# EAGLE board vocore2-motherboard (EAGLE 9.3.2)
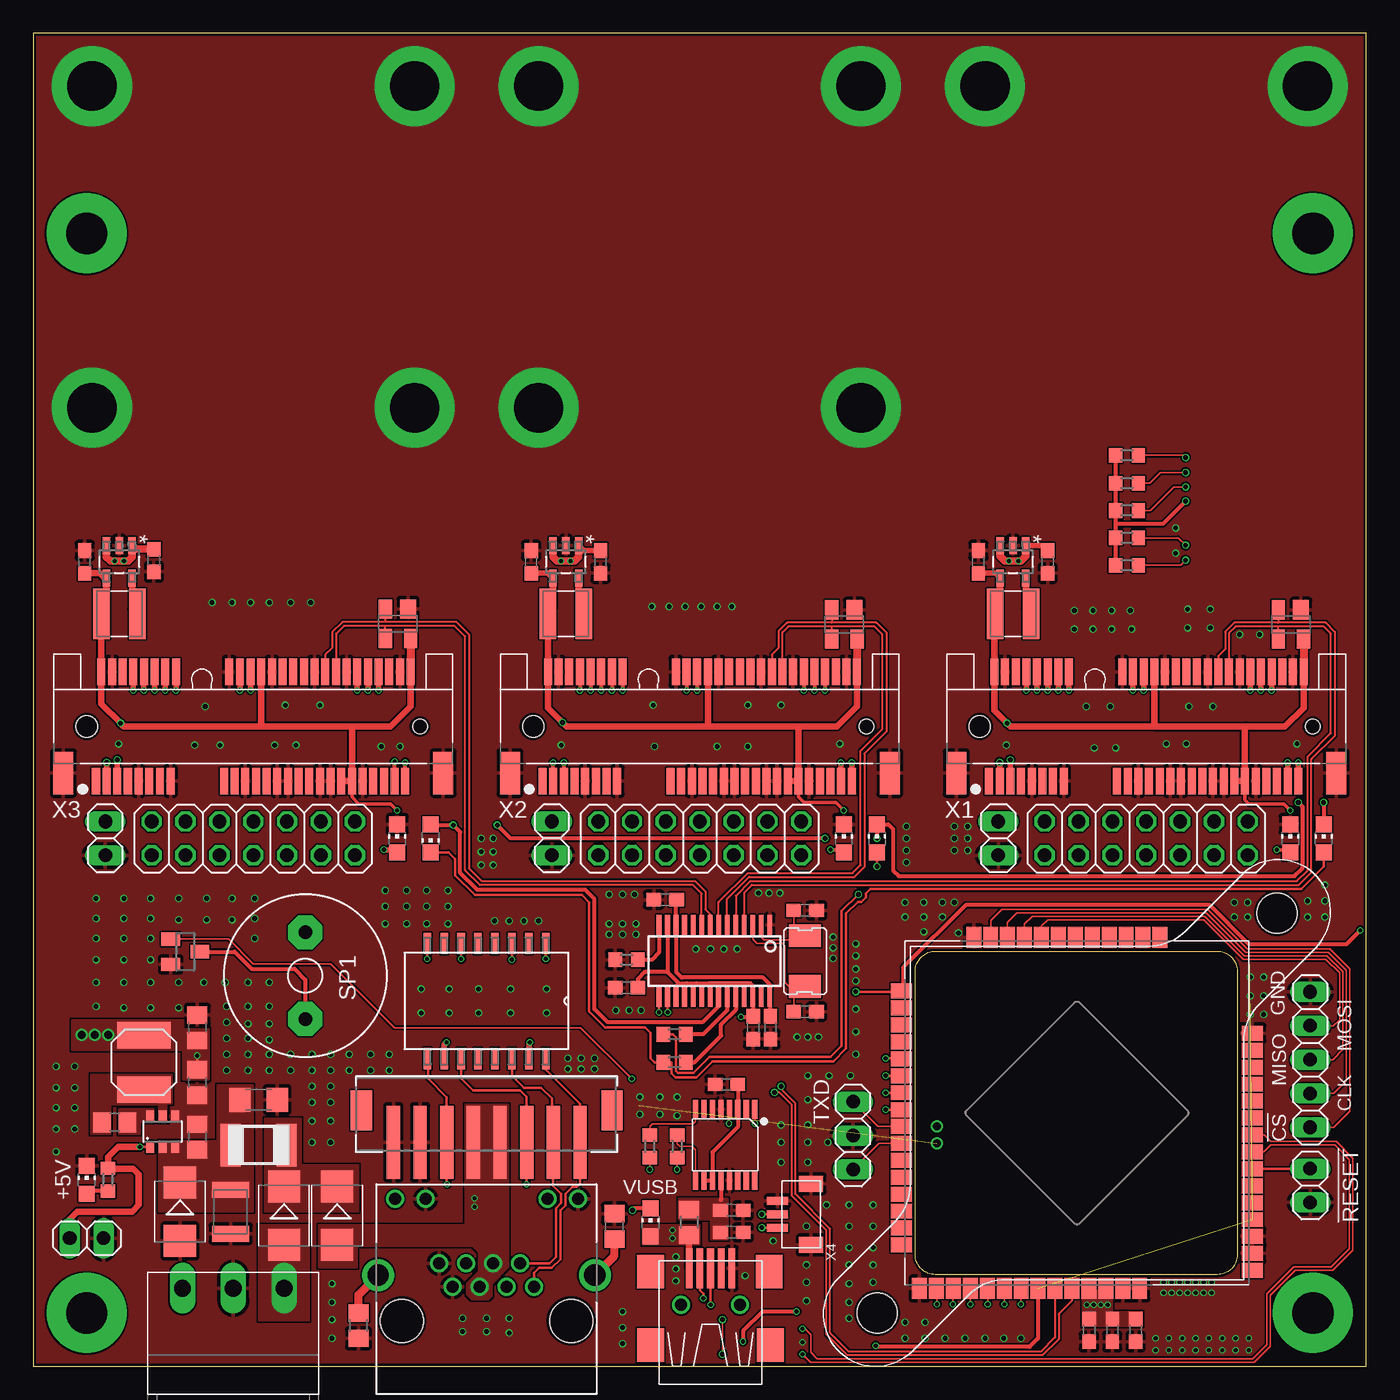
[diagram p4: board, top side]
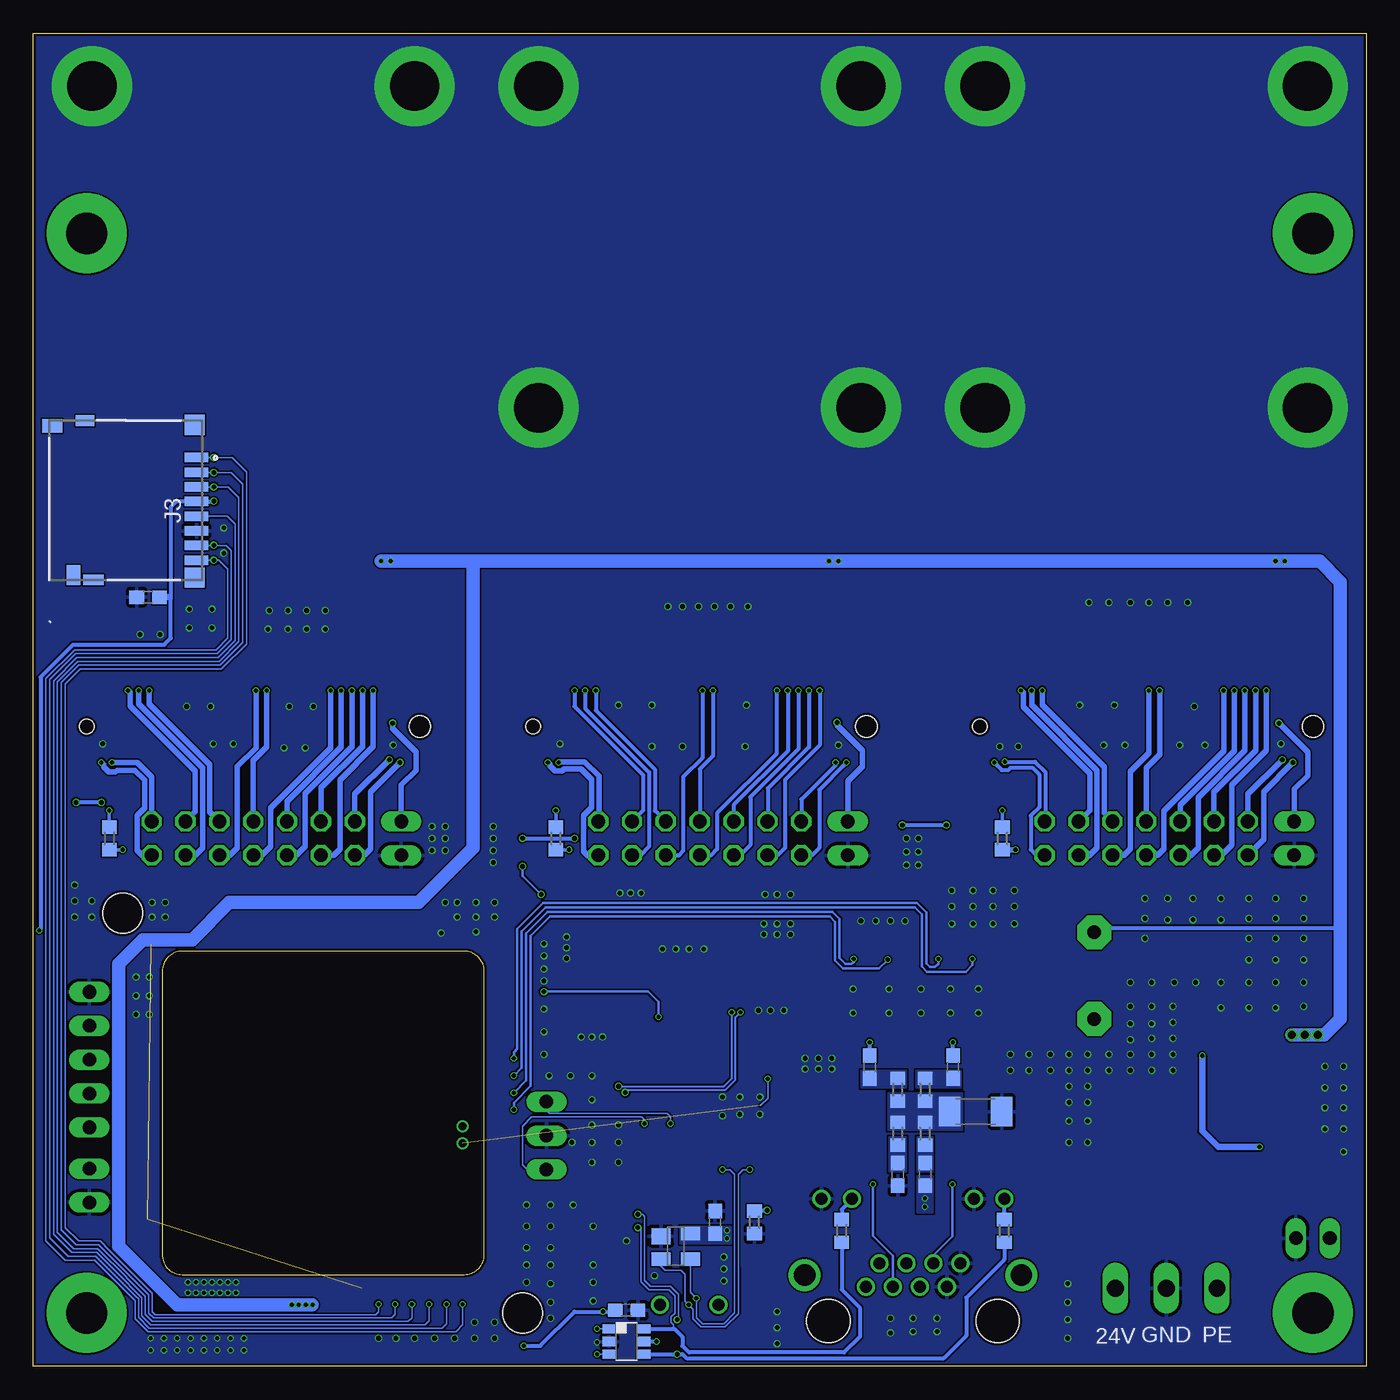
[diagram p5: board, bottom side, seen from below]

Size 100 x 100 mm. Coordinates in mm from the lower left corner, seen from the top.
Outline: 0,0 100,0 100,100 0,100 0,0
Copper layers (1*16): Top 0.035559375mm / dielectric 1.6mm / Bottom 0.035559375mm
Design rules "jlcpcb2layer": minimum track width 5mil, minimum drill 12mil, track to track 5mil, track to pad 5mil, pad to pad 5mil, via to via 5mil, smd to smd 5mil, copper to edge 8mil, drill to drill 6mil, minimum pad ring 5mil, minimum via ring 3mil, stop-mask expansion 2.5mil, vias tented up to drill 0mil, thermal gap 10mil

## Footprints (pad centres in the part's own frame; a part is rotated, then mirrored left to right if it is on the bottom)
C0805 = smd 1.3 x 1.5: 1 -0.95,0; 2 0.95,0
C0603 = smd 1.1 x 1: 1 -0.85,0; 2 0.85,0
C1206 = smd 1.6 x 1.8: 1 -1.4,0; 2 1.4,0
C1808 = smd 1.6 x 2.2: 1 -1.95,0; 2 1.95,0
SMB = smd 2.4 x 2.4: A 2.2,0; C -2.2,0
SOT143 = smd 1.2 x 1.44: 1 -0.75,-1.1 | smd 1 x 1.44: 2 0.95,-1.1; 3 0.95,1.1; 4 -0.95,1.1
1812 = smd 1.5 x 3.2: 1 -2.1,0; 2 2.1,0
SOT23-6 = smd 0.6 x 0.9: 1 -0.95,-1.15; 2 0,-1.15; 3 0.95,-1.15; 4 0.95,1.15; 5 0,1.15; 6 -0.95,1.15
FE1.1S_SSOP-28 = smd 0.35 x 1.5: 1 -4.16,-2.7; 2 -3.52,-2.7; 3 -2.88,-2.7; 4 -2.24,-2.7; 5 -1.6,-2.7; 6 -0.96,-2.7; 7 -0.32,-2.7; 8 0.32,-2.7; 9 0.96,-2.7; 10 1.6,-2.7; 11 2.24,-2.7; 12 2.88,-2.7; 13 3.52,-2.7; 14 4.16,-2.7; 15 4.16,2.7; 16 3.52,2.7; 17 2.88,2.7; 18 2.24,2.7; 19 1.6,2.7; 20 0.96,2.7; 21 0.32,2.7; 22 -0.3,2.7; 23 -0.96,2.7; 24 -1.6,2.7; 25 -2.24,2.7; 26 -2.88,2.7; 27 -3.52,2.7; 28 -4.16,2.7
SOT95P284X122-5N = smd 1.27 x 0.559: 1 -1.219,0.965; 2 -1.219,0; 3 -1.219,-0.965; 4 1.219,-0.965; 5 1.219,0.965
DBV_R-PDSO-G6 = smd 0.69 x 0.99: 1 -0.95,-1.29; 2 0,-1.29; 3 0.95,-1.29; 4 0.95,1.3; 5 0,1.3; 6 -0.95,1.3
SSOP16-0.635-5X4MM = smd 0.381 x 1.397: 1 -2.223,-2.667; 2 -1.587,-2.667; 3 -0.953,-2.667; 4 -0.318,-2.667; 5 0.318,-2.667; 6 0.953,-2.667; 7 1.587,-2.667; 8 2.223,-2.667; 9 2.223,2.667; 10 1.587,2.667; 11 0.953,2.667; 12 0.318,2.667; 13 -0.318,2.667; 14 -0.953,2.667; 15 -1.587,2.667; 16 -2.223,2.667
AMPHENOL_RJHSE-5381 = drill 0.9: 1 3.55,2.54; 2 2.53,4.32; 3 1.52,2.54; 4 0.5,4.32; 5 -0.51,2.54; 6 -1.53,4.32; 7 -2.54,2.54; 8 -3.56,4.32; 9 6.86,9.14; 10 4.57,9.14; 11 -4.57,9.14; 12 -6.86,9.14 | drill 1.6: S1 8.13,3.43; S2 -8.13,3.43 | hole 3.25: 6.35,0; -6.35,0
CONN8_1775470-8 = smd 1 x 5.5: 1 -7.015,0; 2 -5.015,0; 3 -3.015,0; 4 -1.015,0; 5 0.985,0; 6 2.985,0; 7 4.985,0; 8 6.985,0 | smd 1.6 x 3: 9 -9.415,-2.4; 10 9.385,-2.4
AMPHENOL_1140084168 = smd 0.7 x 1.75: 1 9.175,-11.038; 6 3.675,-11.038 | smd 0.701 x 1.753: 2 8.075,-11.038; 8 1.475,-11.038 | smd 0.701 x 1.752: 3 6.975,-11.038; 4 5.875,-11.038; 5 4.775,-11.038; 7 2.575,-11.038 | smd 1.501 x 1.501: 9 0.175,-10.913 | smd 1.502 x 1.502: 10 11.625,-10.913 | smd 0.801 x 1.501: 11 0,-3.313 | smd 0.8 x 1.401: 12 11.95,-2.663 | smd 1.001 x 1.502: CD1 11.55,-0.213 | smd 1.5 x 1: CD2 0.355,-1.813
2X07 = drill 1.016 octagon: 1 -7.62,-1.27; 2 -7.62,1.27; 3 -5.08,-1.27; 4 -5.08,1.27; 5 -2.54,-1.27; 6 -2.54,1.27; 7 0,-1.27; 8 0,1.27; 9 2.54,-1.27; 10 2.54,1.27; 11 5.08,-1.27; 12 5.08,1.27; 13 7.62,-1.27; 14 7.62,1.27
1X03 = drill 1.016 long: 1 -2.54,0; 2 0,0; 3 2.54,0
1X05 = drill 1.016 long: 1 -5.08,0; 2 -2.54,0; 3 0,0; 4 2.54,0; 5 5.08,0
1X02 = drill 1.016 long: 1 -1.27,0; 2 1.27,0
4.90X4.90 = smd 2 x 4: P$1 -2.05,0; P$2 2.05,0
SO3314 = smd 1.25 x 3.8: 1 1.35,0; 2 -1.35,0
L0805 = smd 1.3 x 1.5: 1 -0.95,0; 2 0.95,0
CHIP-LED0805 = smd 1.2 x 1.2: A 0,-1.05; C 0,1.05
SOT23 = smd 1 x 1.4: 1 -0.95,-1.1; 2 0.95,-1.1; 3 0,1.1
R0603 = smd 1 x 1.1: 1 -0.85,0; 2 0.85,0
CT/CN1210 = smd 1.2 x 2.8: 1 -1.65,0; 2 1.65,0
AL60P = drill 1.016 pad 2.54 octagon: 1 -3.251,0; 2 3.251,0
VOCORE2_SMD = smd 1.12 x 1.58: 16_2 4.956,13.16; 17_2 6.226,13.16; 18_2 3.686,13.16; 19_2 2.416,13.16; 20_2 1.146,13.16; 21_2 -0.124,13.16; 24_2 -1.394,13.16; 25_2 -5.204,13.16; 26_2 -3.934,13.16; 27_2 -2.664,13.16; 28_2 -6.474,13.16; 51_2 -10.538,-13.16; 52_2 -9.268,-13.16; 54_2 -7.998,-13.16; 55_2 -6.728,-13.16; 56_2 -5.458,-13.16; 57_2 -4.188,-13.16; 61_2 -1.648,-13.16; 62_2 -0.378,-13.16; +3.3V_5 -2.918,-13.16; +5.0V_3 0.892,-13.16; +5.0V_4 2.162,-13.16; GND8 -11.808,-13.16; GND9 3.432,-13.16; GND10 4.702,-13.16; GND14 -7.744,13.16 | smd 1.58 x 1.12: 29_2 -13.16,5.337; 30_2 -13.16,7.877; 31_2 -13.16,6.607; 33_2 -13.16,4.067; 34_2 -13.16,2.797; 35_2 -13.16,1.527; 36_2 -13.16,0.247; 43_2 -13.16,-1.013; 44_2 -13.16,-2.283; 45_2 -13.16,-3.553; 46_2 -13.16,-4.823; 47_2 -13.16,-6.093; 48_2 -13.16,-7.363; 49_2 -13.16,-8.633; 50_2 -13.16,-9.903; 136_2 13.16,-6.728; 137_2 13.16,-5.458; 138_2 13.16,-4.188; 139_2 13.16,-0.378; 140_2 13.16,0.892; 141_2 13.16,2.162; 142_2 13.16,-2.918; 143_2 13.16,-1.648; 147_2 13.16,3.432; 148_2 13.16,4.702; +1.8V_2 13.16,-11.808; +3.3V_4 -13.16,9.147; +3.3V_6 13.16,-7.998; GND11 13.16,-10.538; GND12 13.16,-9.268; GND13 13.16,5.972 | drill 0.61: 40 -10.512,-1.013; 42 -10.512,-2.283
7A = smd 1.7 x 2.4: 1 -1.9,0; 2 1.9,0
S558-5999-U7-F = smd 1.589 x 0.568: 1 -4.318,4.445; 2 -4.318,3.175; 3 -4.318,1.905; 4 -4.318,0.635; 5 -4.318,-0.635; 6 -4.318,-1.905; 7 -4.318,-3.175; 8 -4.318,-4.445; 9 4.318,-4.445; 10 4.318,-3.175; 11 4.318,-1.905; 12 4.318,-0.635; 13 4.318,0.635; 14 4.318,1.905; 15 4.318,3.175; 16 4.318,4.445
ATS-P1-138-C2-R0 = hole 3: 15,15; -15,-15
TE_1775838-2-FULL = smd 0.6 x 2: 1 -11.8,-4.1; 2 -11.4,4.1; 3 -11,-4.1; 4 -10.6,4.1; 5 -10.2,-4.1; 6 -9.8,4.1; 7 -9.4,-4.1; 8 -9,4.1; 9 -8.6,-4.1; 10 -8.2,4.1; 11 -7.8,-4.1; 12 -7.4,4.1; 13 -7,-4.1; 14 -6.6,4.1; 15 -6.2,-4.1; 16 -5.8,4.1; 17 -2.2,-4.1; 18 -1.8,4.1; 19 -1.4,-4.1; 20 -1,4.1; 21 -0.6,-4.1; 22 -0.2,4.1; 23 0.2,-4.1; 24 0.6,4.1; 25 1,-4.1; 26 1.4,4.1; 27 1.8,-4.1; 28 2.2,4.1; 29 2.6,-4.1; 30 3,4.1; 31 3.4,-4.1; 32 3.8,4.1; 33 4.2,-4.1; 34 4.6,4.1; 35 5,-4.1; 36 5.4,4.1; 37 5.8,-4.1; 38 6.2,4.1; 39 6.6,-4.1; 40 7,4.1; 41 7.4,-4.1; 42 7.8,4.1; 43 8.2,-4.1; 44 8.6,4.1; 45 9,-4.1; 46 9.4,4.1; 47 9.8,-4.1; 48 10.2,4.1; 49 10.6,-4.1; 50 11,4.1; 51 11.4,-4.1; 52 11.8,4.1 | drill 3.7 pad 6: P$1 -12.1,48.05; P$2 12.1,48.05 | smd 1.5 x 3.2: SH1 -14.25,-3.5; SH2 14.25,-3.5 | hole 1.6: -12.5,0 | hole 1.1: 12.5,0
TE_1775838-2 = smd 0.6 x 2: 1 -11.8,-4.1; 2 -11.4,4.1; 3 -11,-4.1; 4 -10.6,4.1; 5 -10.2,-4.1; 6 -9.8,4.1; 7 -9.4,-4.1; 8 -9,4.1; 9 -8.6,-4.1; 10 -8.2,4.1; 11 -7.8,-4.1; 12 -7.4,4.1; 13 -7,-4.1; 14 -6.6,4.1; 15 -6.2,-4.1; 16 -5.8,4.1; 17 -2.2,-4.1; 18 -1.8,4.1; 19 -1.4,-4.1; 20 -1,4.1; 21 -0.6,-4.1; 22 -0.2,4.1; 23 0.2,-4.1; 24 0.6,4.1; 25 1,-4.1; 26 1.4,4.1; 27 1.8,-4.1; 28 2.2,4.1; 29 2.6,-4.1; 30 3,4.1; 31 3.4,-4.1; 32 3.8,4.1; 33 4.2,-4.1; 34 4.6,4.1; 35 5,-4.1; 36 5.4,4.1; 37 5.8,-4.1; 38 6.2,4.1; 39 6.6,-4.1; 40 7,4.1; 41 7.4,-4.1; 42 7.8,4.1; 43 8.2,-4.1; 44 8.6,4.1; 45 9,-4.1; 46 9.4,4.1; 47 9.8,-4.1; 48 10.2,4.1; 49 10.6,-4.1; 50 11,4.1; 51 11.4,-4.1; 52 11.8,4.1 | drill 3.7 pad 6: P$1 -12.1,48.05; P$2 12.1,48.05; P$3 -12.1,23.9; P$4 12.1,23.9 | smd 1.5 x 3.2: SH1 -14.25,-3.5; SH2 14.25,-3.5 | hole 1.6: -12.5,0 | hole 1.1: 12.5,0
BM03B-SRSS-TB = smd 0.6 x 1.55: 1 -1,1.775; 2 0,1.775; 3 1,1.775 | smd 1.2 x 1.8: G1 -2.3,-0.75; G2 2.3,-0.75
MC3-G = drill 1.27 long: 1 -3.81,0; 2 0,0; 3 3.81,0
USB-MB-S = smd 3 x 0.5: D+ 2.75,0; D- 2.75,0.8; GND 2.75,-1.6; ID 2.75,-0.8; VBUS 2.75,1.6 | smd 2.5 x 2: P$1 -3,-4.5; P$2 -3,4.5; P$3 2.5,-4.4; P$4 2.5,4.5 | drill 0.9: P$5 0,2.2; P$6 0,-2.2

## Placement (x,y rotation side)
C1  10uF / 35V  [C0805]  12.3,17.2 90 top
C2  22uF / 10V  [C0805]  12.3,21.3 270 top
C3  18pF  [C0603]  57.9,34.2 0 top
C4  18pF  [C0603]  57.9,26.6 0 top
C5  10uF  [C0603]  54,25.4 270 top
C6  100nF  [C0603]  44.5,28.4 180 top
C7  22uF / 10V  [C0805]  12.3,25.4 90 top
C8  10uF  [C0603]  55.3,25.4 270 top
C9  100nF  [C0603]  47.4,35 180 top
C10  100nF  [C0805]  6.1,18.3 0 top
C11  4.7µF  [C0603]  42.55,60.35 270 top
C12  10µF  [C0603]  37.35,60.35 90 top
C13  4.7µF  [C0603]  9.05,60.45 270 top
C14  10µF  [C0603]  3.85,60.35 90 top
C15  10nF  [C0603]  48.85,10.8 90 bottom
C16  100nF  [C0603]  55.5,4.2 0 bottom
C17  100nF  [C0603]  82.7,2.7 270 top
C18  4.7µF 50V  [C1206]  16.9,20 0 top
C19  100nF  [C0603]  80.95,2.7 270 top
C20  1nF / 100V  [C0603]  37.25,22.45 90 bottom
C21  1nF / 100V  [C0603]  31,22.45 90 bottom
C22  1nF / 100V  [C0603]  33.1,14.4 270 bottom
C23  1nF / 100V  [C0603]  35.15,14.4 270 bottom
C24  1nF / 2.5kV  [C1808]  29.3,19.1 180 bottom
C25  10uF  [C0603]  79.2,2.7 270 top
C26  100nF  [C0603]  91.4,57.7 180 bottom
C27  100nF  [C0603]  52.4,10.05 0 top
C28  4.7uF  [C0603]  52.4,11.7 0 top
C29  100nF  [C0603]  52,21.15 180 top
C32  4.7µF  [C0603]  76.1,60.35 270 top
C33  10µF  [C0603]  70.9,60.35 90 top
C57  10nF 500V  [C0805]  43.6,10.5 90 top
D1  1SMB5935B  [SMB]  11,11.6 270 top
D2  [SMB]  22.8,11.3 270 top
D3  [SMB]  18.8,11.3 270 top
D4  PRTR5V0U2X  [SOT143]  51.8,9 270 bottom
D5  PRTR5V0U2X  [SOT143]  27.35,55.7 180 top
D6  PRTR5V0U2X  [SOT143]  60.85,55.65 180 top
D7  PRTR5V0U2X  [SOT143]  94.35,55.65 180 top
F1  500mA  [1812]  16.9,16.6 180 top
IC1  AP63205  [SOT23-6]  9.7,17.6 0 top
IC2  FE1.1S  [FE1.1S_SSOP-28]  51.1,30.4 180 top
IC3  LM3671MF-3.3  [SOT95P284X122-5N]  39.95,60.35 270 top
IC4  LM3671MF-3.3  [SOT95P284X122-5N]  73.5,60.35 270 top
IC5  LM3671MF-3.3  [SOT95P284X122-5N]  6.45,60.35 270 top
IC7  742G17DBV  [DBV_R-PDSO-G6]  55.5,1.85 270 bottom
IC8  FT230XS-R  [SSOP16-0.635-5X4MM]  51.9,16.6 180 top
J1  RJHSE-5381  [AMPHENOL_RJHSE-5381]  34,3.4 0 top
J2  TE_1775470-8  [CONN8_1775470-8]  34,16.8 180 top
J3  AMPHENOL_1140084168  [AMPHENOL_1140084168]  98.8,59 90 bottom
JP1  [2X07]  50,39.6 0 top
JP2  [2X07]  16.5,39.6 0 top
JP3  [2X07]  83.5,39.6 0 top
JP4  [1X03]  61.5,17.3 270 top
JP5  [1X05]  95.8,23 90 top
JP6  [1X02]  95.8,13.55 270 top
JP7  [1X02]  4,9.6 0 top
JP8  [1X02]  5.4,39.6 270 top
JP9  [1X02]  38.9,39.6 270 top
JP10  [1X02]  72.4,39.6 270 top
L1  4.7uH / 2.6A  [4.90X4.90]  8.3,22.8 90 top
L2  2.2µH  [SO3314]  39.95,56.45 0 top
L3  2.2µH  [SO3314]  6.45,56.45 0 top
L4  [L0805]  49.2,10.8 270 top
L8  [L0805]  24.4,3.05 90 top
L10  2.2µH  [SO3314]  73.5,56.45 0 top
LED1  ORANGE  [CHIP-LED0805]  94.3,39.6 0 top
LED2  ORANGE  [CHIP-LED0805]  60.8,39.6 0 top
LED3  RED  [CHIP-LED0805]  4,14 0 top
LED4  ORANGE  [CHIP-LED0805]  27.3,39.6 0 top
LED5  GREEN  [CHIP-LED0805]  29.8,39.6 180 top
LED6  GREEN  [CHIP-LED0805]  63.3,39.6 0 top
LED7  GREEN  [CHIP-LED0805]  96.8,39.6 0 top
LED8  GREEN  [CHIP-LED0805]  46.3,10.8 0 top
Q1  BSS123  [SOT23]  11.4,31.1 270 top
R1  2k7 / 1%  [R0603]  44.5,30.5 0 top
R2  470R  [R0603]  94.3,39.6 90 bottom
R3  470R  [R0603]  5.6,14 90 top
R4  470R  [R0603]  60.8,39.6 90 bottom
R5  470R  [R0603]  27.3,39.6 90 bottom
R6  100R  [R0603]  48.1,24.9 180 top
R7  VARISTORCN1210  [CT/CN1210]  14.8,11.6 90 top
R8  75R  [R0603]  33.1,20.75 270 bottom
R9  75R  [R0603]  35.15,20.75 270 bottom
R10  100R  [R0603]  48.1,22.8 180 top
R11  10k  [R0603]  82.05,62.15 180 top
R12  75R  [R0603]  33.1,17.45 90 bottom
R13  75R  [R0603]  35.15,17.45 90 bottom
R14  820R  [R0603]  39.35,10.15 90 bottom
R15  820R  [R0603]  27.15,10.15 90 bottom
R16  10k  [R0603]  82.05,64.2 180 top
R17  10k  [R0603]  82.05,66.25 180 top
R18  10k  [R0603]  82.05,68.35 180 top
R19  10k  [R0603]  82.05,60.1 180 top
R20  27R  [R0603]  48.3,16.5 90 top
R21  27R  [R0603]  46.25,16.5 270 top
R22  330R  [R0603]  45.9,10.8 90 bottom
SP1  AL60P  [AL60P]  20.4,29.3 270 top
U1  VOCORE2-SMD  [VOCORE2_SMD]  78.3,19 0 top
U2  12MHz  [7A]  57.9,30.4 90 top
U4  S558-5999-U7-F  [S558-5999-U7-F]  34,27.4 270 top
U$1  [ATS-P1-138-C2-R0]  78.3,19 0 top
X1  TE_1775838-2-FULL  [TE_1775838-2-FULL]  83.5,48 0 top
X2  TE_1775838-2  [TE_1775838-2]  50,48 0 top
X3  TE_1775838-2  [TE_1775838-2]  16.5,48 0 top
X4  BM03B-SRSS-TB  [BM03B-SRSS-TB]  57.6,11.4 90 top
X5  MC3-G  [MC3-G]  15,5.85 0 top
X6  [USB-MB-S]  50.8,4.6 90 top

## Tracks (layer width: path | path; a pad name or v marks a point on that pad's centre or on a via)
!VC_RESET
  Top 0.2: U1.138_2 JP6.1
+5V  (via drill 0.31, 0.6)
  Top 0.2: C2.1 v12.3,23.3 | v8,16.45 IC1.1
  Top 0.4: C11.1 41.28,61.2 IC3.1 | IC4.1 75.73,61.57 C32.1 | 5.65,14.8 R3.2 | JP7.1 2.7,9.63
  Top 0.5: R3.2 5.6,15.7 6.35,16.45 v8,16.45 | 5.65,14.8 7.5,14.8 7.9,14.4 7.9,12.1 7.4,11.6 3.3,11.6 2.7,11 2.7,9.63
  Top 0.55: IC5.3 5.48,60.72 5.8,60.4 v6.1,60.4 v6.8,60.4 7.1,60.4 7.41,60.72 IC5.1 7.68,61.3 C13.1 | IC3.3 38.98,60.72 39.3,60.4 v39.6,60.4 v40.3,60.4 40.6,60.4 40.91,60.72 IC3.1 | IC4.3 72.53,60.77 72.9,60.4 v73.2,60.4 v73.9,60.4 74.1,60.4 74.47,60.77 IC4.1
  Bottom 0.127: v79.05,4.6 79.1,4.6
  Bottom 0.3: SP1.1 20.05,32.9 1.93,32.9
  Bottom 0.5: v12.3,23.3 12.3,17.65 11.1,16.45 v8,16.45
  Bottom 1: 67,60.4 v40.3,60.4 v6.8,60.4 3.5,60.4 1.93,58.83 1.93,32.9 1.93,26.07 3.15,24.85 v3.65,24.85 v4.6,24.85 v5.6,24.85 | 67,60.4 v73.9,60.4 | 67,60.4 67,38.9 71.1,34.8 85.3,34.8 88.1,32 91.8,32 93.6,30.2 93.6,8.98 89.22,4.6 79.1,4.6
  other vias: 79.55,4.6 80.1,4.6 80.6,4.6
  pour Top (no thermals): 2.9,26 2.9,23.7 11.2,23.7 11.2,21.5 13.2,21.5 13.2,25.3 11.3,25.3 11.3,26
  pour Top (no thermals): 78.7,5.7 78.7,3 83.2,3 83.2,4.1 80.95,4.1 80.95,5.7
+24V
  pour Top (no thermals): 24.4,11.6 24.4,15.1 20.1,15.1 20.1,18.6 17.35,18.6 17.35,11.6
FT230_VCCIO
  Top 0.3: C29.1 IC8.3 52.85,17.95 50.95,16.05 IC8.11 IC8.10
GND  (via drill 0.31, 0.35)
  other vias: 32.2,3.6 34,2.6 34,3.6 32.2,2.6 35.7,3.6 35.7,2.5 22.4,6.2 22.4,4.8 22.4,3.5 22.4,2.1 46.4,57 47.7,57 48.9,57 50.1,57 51.3,57 52.4,57 46.6,46.5 46.5,49.6 53.6,49.6 56.1,49.6 51.3,46.5 53.6,46.5 60.5,46.7 39.6,46.6 12.9,49.5 18.9,49.6 21.5,49.6 18.1,46.6 19.7,46.6 12.1,46.6 14,46.6 13.4,57.3 14.9,57.3 16.3,57.3 17.7,57.3 19.3,57.3 20.8,57.3 94.8,46.7 86.7,49.5 88.5,49.5 85,46.7 86.5,46.7 79,49.5 80.8,49.5 79.6,46.4 81.2,46.4 1.7,22.5 1.7,20.9 1.7,19.4 1.7,17.8 1.7,16.1 61.7,31.7 61.7,28.9 61.7,30.8 61.7,29.8 33.6,37.6 33.6,38.6 33.6,39.6 34.5,37.6 34.5,38.6 34.5,39.6 69.1,38.7 69.1,39.6 69.1,40.5 70.1,38.7 70.1,39.6 70.1,40.5 49.7,31.3 50.8,31.3 51.8,31.3 52.8,31.3 57.3,24.7 58.1,24.7 58.9,24.7 44.2,35.4 45.1,35.4 44.2,33.2 45.2,33.2 44.2,32.4 45.2,32.4 43.2,32.4 43.2,33.2 43.2,35.4 60,32.2 60,31.4 60,30.6 54.4,35.5 55.2,35.5 56,35.5 4.7,35.1 6.8,35.1 8.8,35.1 10.9,35.1 4.7,33.6 6.8,33.6 8.8,33.6 10.9,33.5 4.7,30.5 6.8,30.5 8.8,30.5 4.7,28.8 6.8,28.8 8.8,28.8 10.9,28.8 29.1,28.3 31.2,28.3 33.4,28.3 35.8,28.3 38.5,28.3 38.5,26.5 35.8,26.5 33.4,26.5 31.2,26.5 29.1,26.5 58.1,21.8 59.7,21.8 58.1,18.1 58.1,16.8 58.1,15.3 59.6,16.8 14.5,22.2 16.1,22.2 17.7,22.2 19.3,22.2 20.9,22.2 22.3,22.2 23.7,22.2 20.9,21 20.9,19.8 20.9,18.4 20.9,16.8 22.3,21 22.3,19.8 22.3,18.4 22.3,16.8 25.3,22.2 26.7,22.2 26.7,23.4 25.3,23.4 23.7,23.4 22.3,23.4 20.9,23.4 19.3,23.4 17.7,23.4 16.1,23.4 14.5,23.4 26.4,35.7 28,35.7 29.5,35.7 31.1,35.7 26.4,34.5 28,34.5 29.5,34.5 31.1,34.5 26.4,33.2 28,33.2 29.5,33.2 31.1,33.2 65.4,34.8 66.8,34.8 68.2,34.8 65.4,33.7 66.8,33.7 68.2,33.7 66.8,32.6 13,33.5 13,35.1 14.9,35.1 14.9,33.5 16.6,35.1 12.8,28.8 34.6,33.4 35.7,33.4 36.8,33.4 37.9,33.4 78.1,56.7 79.5,56.7 80.9,56.7 82.3,56.7 78.1,55.3 79.5,55.3 80.9,55.3 82.4,55.3 85.7,62.9 85.7,61 44.2,4.1 44.2,2.9 44.2,1.7 43.7,26.7 44.7,26.7 45.6,26.7 40.1,23.1 41.1,23.1 42.1,23.1 40.1,22.3 41.1,22.3 42.1,22.3 61.7,23.4 61.7,25.1 61.7,26.8 86.6,56.8 88.3,56.8 86.6,55.4 88.3,55.4 90.5,54.9 92,54.9 61.3,21.8 48.3,20.2 47,20.2 45.5,20.2 48.3,18.8 47,18.9 45.5,18.9 3.1,22.5 3.1,20.9 3.1,19.4 3.1,17.8 57.7,1.8 84.2,2.1 85.2,2.1 86.2,2.1 87.2,2.1 88.2,2.1 89.2,2.1 90.2,2.1 91.2,2.1 86.2,1.2 87.2,1.2 88.2,1.2 89.2,1.2 90.2,1.2 91.2,1.2 85.2,1.2 84.2,1.2 58,10.5 59.5,12.1 61.2,12.1 61.2,10.5 63,12.1 63,10.5 58,7.6 58,6.3 58,4.9 61.2,8.9 61.2,7.6 61.2,6.2 61.2,4.8 63,8.9 63,7.6 63,6.3 4.7,32.1 6.8,32.1 8.8,32.1 65.4,2.1 66.9,2.1 68.4,2.1 61.2,3.6 65.4,3.3 66.9,3.3 69.9,2.1 71.4,2.1 72.8,2.1 74.1,2.1 4.7,27 6.8,26.9 8.8,26.9 10.9,26.9 14.5,24.6 14.5,25.8 16.1,24.6 16.1,25.7 14.5,27 16.1,27 17.7,24.5 17.7,25.7 17.7,27 14.4,28.8 16.1,28.8 17.7,28.8 16.6,33.6 16.6,32.1 91.3,29.2 92.3,29.2 91.3,27.8 92.3,27.8 91.3,26.4 92.3,26.4 69.4,32.5 69.1,34.8 6.4,46.7 26.1,46.5 27.5,46.5 73,46.6 90.1,34.8 90.1,33.7 91.1,33.7 91.1,34.8 95.6,34.9 95.6,33.7 96.9,34.9 96.9,33.7 96.9,36.1 56.1,18.1 56.1,16.8 56.1,15.3 58.1,20 55.5,9.4 53.4,6.8 48.2,8.2 48.2,7.3 48.2,6.4 84.8,5.5 85.4,5.5 86,5.5 86.6,5.5 87.2,5.5 87.8,5.5 88.4,5.5 88.4,6.3 87.8,6.3 87.2,6.3 86.6,6.3 86,6.3 85.4,6.3 84.8,6.3 65.5,40.5 65.5,39.6 65.5,38.7 65.5,37.8
  pour Top (rank 2): 0,100 100,100 100,0 0,0
  pour Bottom (rank 2): 0,100 100,100 100,0 0,0
  pour Top (no thermals): 13.3,21.15 13.3,17.2 10.3,17.2 10.3,19.45 11.2,19.45 11.2,21.15
LED_LAN_ACT  (via drill 0.31)
  Top 0.127: v57.7,0.9 58.3,0.3 91.6,0.3 92.8,1.5 92.8,5.3 92.81,5.31 92.81,5.32 94.69,7.2 97.5,7.2 99,8.7 99,15.6 97.75,16.85 92.85,16.85 92.35,17.35 U1.143_2
  Bottom 0.127: v57.7,0.9 IC7.3
LED_LAN_LNK  (via drill 0.31)
  Top 0.127: v57.7,2.8 57.9,2.8 58.33,2.37 58.33,1.03 58.8,0.55 91.5,0.55 92.55,1.6 92.55,5.42 94.58,7.45 97.4,7.45 98.75,8.8 98.75,15.49 97.64,16.6 92.85,16.6 92.33,16.08 92,16.08 U1.142_2
  Bottom 0.127: v57.7,2.8 IC7.1
N$1  (via drill 3.1 pad 6)
  other vias: 4,85
N$2  (via drill 3.1 pad 6)
  other vias: 96,85
N$3  (via drill 3.1 pad 6)
  other vias: 96,4
N$4  (via drill 3.1 pad 6)
  other vias: 4,4
N$5
  pour Top (no thermals): 4.3,21.9 4.3,17.4 5.81,17.4 5.81,19.6 9.4,19.6 9.4,18.3 10,18.3 10,19.7 10.4,19.7 10.4,21.9
N$6
  Top 0.5: IC3.5 40.91,56.84 L2.1
N$7  (via drill 0.31)
  Top 0.4: U4.15 37.17,24.23 v37.25,24.3
  Bottom 0.3: C20.2 v37.25,24.3
N$8
  Top 0.5: IC5.5 7.41,56.84 L3.1
N$9
  Top 0.127: IC2.2 54.62,32.18 54.8,32 57.6,32 57.8,31.8 57.8,32.2 U2.2 57.05,33.15 C3.1
N$10
  Top 0.3: R3.1 4,13.15 LED3.A
N$11
  Top 0.127: IC2.3 53.98,32.02 54.29,31.71 56.19,31.71 56.4,31.5 56.4,28.8 56.7,28.5 57.7,28.5 | 57.7,28.5 U2.1 | C4.1 57.05,27.85 57.7,28.5
N$12
  Top 0.3: IC2.14 46.94,31.04 46.4,30.5 R1.2
N$13  (via drill 0.31)
  Top 0.25: v93.3,38.75 94.1,38.75 LED1.A
  Bottom 0.25: R2.1 v93.3,38.75
N$14  (via drill 0.31)
  Top 0.25: v59.8,38.75 60.6,38.75 LED2.A
  Bottom 0.25: R4.1 v59.8,38.75
N$15  (via drill 0.31)
  Top 0.4: v26.3,38.75 27.1,38.75 LED4.A
  Bottom 0.4: R5.1 v26.3,38.75
N$16  (via drill 0.31)
  Top 0.4: U4.10 30.82,24.12 v31,24.3
  Bottom 0.3: C21.2 v31,24.3
N$17
  pour Bottom (no thermals): 30.4,20.9 33.8,20.9 33.8,22.2 30.4,22.2
N$18
  pour Bottom (no thermals): 34.5,22.2 37.9,22.2 37.9,20.9 34.5,20.9
N$20
  pour Bottom (no thermals): 32.5,14.6 33.7,14.6 33.7,17.2 33.6,17.2 32.5,17.2
N$21
  Top 0.3: SP1.2 20.4,29 19.59,29.81 16.38,29.81 15.09,31.1 Q1.3
N$28
  pour Bottom (no thermals): 34.5,14.6 35.8,14.6 35.8,17.2 34.5,17.2
N$33
  pour Bottom (no thermals): 30.3,17.7 35.9,17.7 35.9,20.5 30.3,20.5
N$35
  Top 0.3: IC8.12 51.58,12.45
  pour Top (no thermals): 48.4,12.6 52.1,12.6 52.1,9.5 50.8,9.5 50.8,11 48.4,11
N$36
  Top 0.127: IC8.9 49.68,16.22 49.4,16.5 48.5,16.5 48.3,16.7 R20.2
N$37  (via drill 0.35)
  Top 0.127: v51.7,3.5 v51.7,0.9
  Top 0.2: X4.2 v54.65,11.4
  Bottom 0.127: v54.65,11.4 54.3,11.4 54.15,11.25 54.15,6.45 53.7,6 52.2,6 51.6,5.4 51.6,3.6 v51.7,3.5
  Bottom 0.3: R15.1 27.15,8 30,5.15 30,2.3 31.7,0.6 51,0.6 51.3,0.9 v51.7,0.9 IC7.4
N$38
  Top 0.127: IC8.8 49.68,18.38 49.5,18.2 46.45,18.2 46.25,18 R21.1
N$39  (via drill 0.35)
  Top 0.3: LED8.C 45.1,11.85 v44.95,11.7
  Bottom 0.3: R22.2 45.85,11.7 v44.95,11.7
N$41
  Bottom 0.3: R15.2 J1.12
N$42
  Bottom 0.3: J1.10 39.35,11.76 R14.2
N$50
  Top 0.5: IC4.5 74.47,56.84 L10.1
N$56
  Top 0.6: L8.2 24.4,5.36 J1.S2
N$57
  Top 0.3: IC2.23 52.06,26.71 50.25,24.9 R6.1
N$58
  Top 0.3: IC2.24 52.7,26.74 51.6,25.64 51.6,24.8 49.6,22.8 R10.1
N$60
  pour Top (no thermals): 16.9,10.6 20.7,10.6 20.7,3.4 16.9,3.4
N$61
  Top 0.6: J1.S1 43.6,8.3 C57.1
N$65
  pour Top (no thermals): 6.4,17.4 8,17.4 8,18.3 9.05,18.3 9.05,19.3 6.4,19.3
N$66  (via drill 0.35)
  Top 0.2: X4.1 v54.65,10.4
  Bottom 0.127: v54.65,10.4 54.55,10.4 54.4,10.25 54.4,6.34 53.8,5.75 52.3,5.75 51.85,5.29 51.85,3.99 52.15,3.69 52.15,3.31 51.95,3.11 51.95,2.95 52.1,2.8
  Bottom 0.3: R14.1 39.35,5.75 38,4.4 38,2.2 39.17,1.03 50.8,1.03 51.3,1.53 51.3,2.2 51.9,2.8 52.1,2.8 IC7.6
P0_RD+  (via drill 0.31)
  Top 0.2: v32.1,30.55 v32.09,30.55 U4.6 | v63.95,23.1 65.11,23.1 U1.33_2
  Bottom 0.2: v32.1,30.55 32.1,30.2 32.35,29.95 32.75,29.95 33.01,30.22 33.01,34.06 33.7,34.75 61.75,34.75 63.7,32.8 63.7,23.8 63.95,23.55 v63.95,23.1
P0_RD-  (via drill 0.31)
  Top 0.2: U4.8 v29.55,30.55 | v63.95,21.8 U1.34_2
  Bottom 0.2: v29.55,30.55 29.55,30.1 30.05,29.6 32.95,29.6 33.35,30 33.35,33.91 33.85,34.41 61.58,34.41 63.36,32.63 63.36,22.39 v63.95,21.8
P0_TD+  (via drill 0.31)
  Top 0.2: U4.1 v38.45,30.55 | v63.95,20.5 65.17,20.5 U1.35_2
  Bottom 0.2: v38.45,30.55 38.45,30.35 38.61,30.19 39.08,30.19 39.51,30.62 39.51,33.55 40.03,34.07 61.41,34.07 63.02,32.46 63.02,21.43 v63.95,20.5
P0_TD-  (via drill 0.31)
  Top 0.2: v35.9,30.5 U4.3 | v63.95,19.25 U1.36_2
  Bottom 0.2: v35.9,30.5 36.55,29.85 39.25,29.85 39.85,30.45 39.85,33.33 40.25,33.73 61.24,33.73 62.68,32.29 62.68,21.02 63.95,19.75 v63.95,19.25
POE_V+  (via drill 0.31)
  other vias: 33.1,11.95 33.1,12.6
  pour Top (no thermals): 21.4,10.6 32.4,10.6 32.4,19.65 35.65,19.65 35.65,7.45 34.4,6.2 34.4,5.3 34.1,5 32.9,5 32.5,5.4 32.5,6.2 33.4,7.1 33.4,8.6 33,9 24.3,9 24.3,7.4 21.4,7.4
  pour Bottom (no thermals): 32.5,11.5 33.7,11.5 33.7,14.3 32.5,14.3
RX+  (via drill 0.31)
  Top 0.2: J2.3 37.02,16.1 | 37.02,16.1 37.02,13.66 v37,13.65 | U4.11 32.09,21.61 33,20.7 36.5,20.7 37,20.2 37,16.11 37.02,16.1
  Bottom 0.2: v37,13.65 37,9.8 35.5,8.3 35.5,5.96 J1.3
RX-  (via drill 0.31)
  Top 0.2: v31.05,13.65 31.02,13.69 J2.6 31.02,20.18 29.6,21.6 29.6,23.04 U4.9
  Bottom 0.2: J1.6 32.47,8.33 31.05,9.75 v31.05,13.65
TX+
  Top 0.2: J2.1 41,16.79 | 41,16.79 41,13.7 40.77,13.47 40.47,13.47 39.93,12.93 39.93,12.07 39.54,11.68 39.54,8.03 38.89,7.38 37.93,7.38 37.55,7 J1.1 | U4.16 38.45,22.25 41,19.7 41,16.79
TX-
  Top 0.2: J1.2 38.72,7.72 39.2,8.2 39.2,11.85 39.6,12.25 39.6,12.93 39,13.53 39,16.79 J2.2 38.9,16.91 38.9,20.1 38.1,20.9 36.8,20.9 35.91,21.8 U4.14
USB_1V8
  Top 0.3: C8.1 55.26,26.29 IC2.28 55.26,28.64 54.73,29.17 48.64,29.17 48.22,29.58 IC2.12 48.22,34.97 C9.1
USB_D+  (via drill 0.31)
  Top 0.127: v50.82,4.6 50.8,4.6 | v46.25,14.75 R21.2
  Top 0.2: X6.D+ 50.8,4.6
  Bottom 0.127: v46.25,14.75 46.75,14.75 47.1,14.4 47.1,7.5 47.1,7.4 47.1,3.94 48.09,2.95 49.91,2.95 50.5,3.54 50.5,4.28 v50.82,4.6 51.1,4.88 51.1,6.9 51.4,7.2 52.6,7.2 52.9,7.5 D4.2
USB_D-  (via drill 0.31)
  Top 0.127: v50.26,5.08 50.27,5.1 50.29,5.1 | R20.1 v48.3,14.75
  Top 0.2: X6.D- 50,5.71 50.29,5.42 50.29,5.1
  Bottom 0.127: v48.3,14.75 47.75,14.75 47.39,14.39 47.39,4.01 48.2,3.2 49.8,3.2 50.25,3.65 v50.25,5.08 v50.26,5.08 50.7,5.53 D4.3
USB_LED1  (via drill 0.35)
  Top 0.2: v61.9,35.4 60.65,34.15 60.65,24.05 59.8,23.2 50.72,23.2 49.54,22.02 48.36,22.02 48.22,22.16 48.22,24.68 48,24.9 R6.2 | v63.3,37.5 LED6.A
  Bottom 0.2: v61.9,35.4 63.3,36.8 v63.3,37.5
USB_LED2
  Top 0.2: LED7.A 96.8,37.49 95.11,35.8 62.81,35.8 62.45,35.45 62.45,35.17 62.13,34.85 61.85,34.85 60.98,33.98 60.98,23.83 60.02,22.86 50.94,22.86 49.76,21.68 48.19,21.68 47.88,21.99 47.88,22.75 47.83,22.8 R10.2 46.6,22.8 46.3,23.1 46.3,25 45.89,25.41 42.91,25.41 41.71,26.61 41.71,34.81 41.17,35.35 33.13,35.35 31.65,36.83 31.65,38.05 31.15,38.55 LED5.C
USB_LED_DRV  (via drill 0.35)
  Top 0.3: IC2.22 51.4,27 50.2,25.8 43.1,25.8 42.1,26.8 42.1,35.05 41.41,35.74 33.32,35.74 32.04,37.02 32.04,40.06 v31.5,40.6 29.85,40.6 LED5.A | v94.9,42.3 95.24,41.96 95.24,37.38 94.62,36.76 64.94,36.76 64.5,37.2 64.5,40.3 64.15,40.65 LED6.C v63.3,39.6 | v96.8,42.3 LED7.C | v59.4,39.6 35.8,39.6 v34.8,40.6
  Bottom 0.3: v94.9,42.3 v96.8,42.3 | v63.3,39.6 v59.4,39.6 | v34.8,40.6 v31.5,40.6
USB_UP_D+  (via drill 0.31, 0.35)
  Top 0.15: U1.61_2 76.65,2.15 75.6,1.1 61.2,1.1 59.78,2.52 59.78,10.31 57.18,12.91 57.18,19.72 56.1,20.8 v56.1,21
  Top 0.2: IC2.16 47.58,26.57 v47.6,26.55
  Bottom 0.15: v56.1,21 48.2,21 47.6,21.6 v47.6,26.55
USB_UP_D-  (via drill 0.31, 0.35)
  Top 0.15: U1.62_2 77.92,4.92 76.93,3.93 76.93,2.04 75.71,0.82 61.08,0.82 59.5,2.4 59.5,10.2 56.9,12.8 56.9,19.6 55.97,20.54 v55.6,20.54
  Top 0.2: IC2.15 v46.94,26.56 v46.95,26.55
  Bottom 0.15: v55.6,20.54 55.41,20.72 48.09,20.72 47.32,21.48 47.32,26.18 v46.95,26.55
V_USB  (via drill 0.31)
  Top 0.5: X6.VBUS L4.2
  other vias: 47.95,10.2 47.95,9.6
  pour Bottom (no thermals): 51.5,10.5 51.5,9.2 47.6,9.2 47.6,10.5
  pour Top (no thermals): 45.7,10.6 50,10.6 50,9.1 45.7,9.1
VC_3V3  (via drill 0.31, 0.35)  (2 unrouted)
  Top 0.127: U1.+3.3V_4 65.29,28.15
  Top 0.2: 61.75,28.15 v61.7,28.1 65.09,28.1 U1.+3.3V_4
  Top 0.3: U1.+3.3V_4 | IC2.21 50.78,28.67 50.73,28.73 | 50.73,28.73 53.77,28.73 53.98,28.52 IC2.26 53.98,26.27 C5.1 53.95,26.2 v53.1,26.2 | IC2.19 49.5,28.5 49.73,28.73 | 49.73,28.73 50.73,28.73 | 49.03,28.73 49.73,28.73 | IC2.18 48.86,28.56 49.03,28.73 | 48.43,28.73 49.03,28.73 | IC2.17 48.22,28.52 48.43,28.73 | IC2.13 47.58,29.57 | 47.58,29.57 48.43,28.73 | C6.1 45.35,29.05 45.87,29.57 47.58,29.57 | v86.45,64.9 84.75,63.2 81.2,63.2 | 81.2,63.2 R16.2 R17.2 R18.2 | 81.2,63.2 R11.2 R19.2 | U1.+3.3V_5 75.38,2.08 74.75,1.45 63.28,1.45 v63.2,1.53 | v57.27,4.1 54.7,4.1 53.25,2.65 v53.25,1.85 | v99.56,32.7 98.51,31.65 91.21,31.65 88.26,34.6 69.96,34.6 65.29,29.94 65.29,28.15
  Bottom 0.2: v61.7,28.1 v61.69,28.11 53.87,28.11 53.1,27.34 v53.1,26.2
  Bottom 0.3: 89.69,57.6 89.69,64.46 89.28,64.88 J3.4 86.47,64.88 v86.45,64.9 | 89.69,57.6 89.69,54.62 90.17,54.13 97.01,54.13 99.44,51.7 99.44,32.82 v99.56,32.7 | 89.69,57.6 89.79,57.7 | v63.2,1.53 61.97,1.53 59.4,4.1 v57.27,4.1 56.45,4.1 C16.1 | v53.25,1.85 IC7.5
  Bottom 0.5: 89.79,57.7 C26.1
VC_PWM1  (via drill 0.31)  (1 unrouted)
  Top 0.127: Q1.1 14.65,32.05 16.5,30.2 22.3,30.2 27.1,25.4 41.06,25.4 v44.9,21.57
  Bottom 0.127: v44.9,21.57 v44.9,21.56 44.9,20.1 45.45,19.55
VC_SD_CLK  (via drill 0.31)
  Top 0.127: v70.3,4.65 U1.54_2
  Bottom 0.127: J3.5 85.47,63.77 84.87,63.17 84.87,54.44 86.13,53.17 96.73,53.17 98.48,51.42 98.48,9.88 97.14,8.53 95.23,8.53 93.7,7 93.7,6.99 91.86,5.15 91.86,3.77 91.19,3.11 70.59,3.11 70.3,3.4 v70.3,4.65
VC_SD_CMD  (via drill 0.31, 0.35)
  Top 0.127: R16.1 83.8,64.2 85.58,65.97 v86.45,65.97 | U1.55_2 71.6,5.81 v71.6,4.65
  Bottom 0.127: J3.3 v86.45,65.97 85.38,65.97 84.58,65.18 84.58,54.36 86.06,52.88 96.66,52.88 98.19,51.34 98.19,10.05 96.96,8.82 95.16,8.82 93,6.67 93,6.65 91.6,5.25 91.6,3.88 91.08,3.36 71.89,3.36 71.6,3.65 v71.6,4.65
VC_SD_D0  (via drill 0.31, 0.35)
  Top 0.127: R11.1 85.9,62.15 v86.45,61.6 | v69,4.65 69,5.81 U1.52_2
  Bottom 0.127: v86.45,61.6 86.47,61.58 J3.7 85.53,61.58 85.16,61.21 85.16,54.51 86.21,53.46 96.81,53.46 98.77,51.5 98.77,9.65 97.36,8.24 95.31,8.24 92.7,5.63 92.7,5.62 92.33,5.25 92.32,5.25 92.11,5.04 92.11,3.67 91.3,2.85 69.35,2.85 69,3.2 v69,4.65
VC_SD_D1  (via drill 0.31, 0.35)
  Top 0.127: R19.1 86.08,60.1 v86.45,60.48 | v67.8,4.65 67.8,5.8 U1.51_2
  Bottom 0.127: J3.8 v86.45,60.48 86.08,60.48 85.41,59.81 85.41,54.62 86.28,53.74 96.89,53.74 99.06,51.58 99.06,9.42 97.59,7.96 95.39,7.96 92.44,5 92.43,5 92.36,4.94 92.36,3.56 91.4,2.6 68.3,2.6 67.8,3.1 v67.8,4.65
VC_SD_D2  (via drill 0.31, 0.35)
  Top 0.127: R18.1 86.28,68.35 v86.45,68.17 | v74.1,4.65 74.1,5.83 U1.57_2
  Bottom 0.127: J3.1 v86.45,68.17 85.08,68.17 84,67.1 84,54.2 85.9,52.3 96.5,52.3 97.6,51.2 97.6,10.4 96.6,9.4 95,9.4 94.3,8.7 94.3,8.69 91.09,5.49 91.09,4.09 90.87,3.87 74.33,3.87 74.1,4.1 v74.1,4.65
VC_SD_D3  (via drill 0.31, 0.35)
  Top 0.127: R17.1 83.75,66.25 84.55,67.05 v86.45,67.05 | U1.56_2 v72.85,4.65
  Bottom 0.127: J3.2 87.74,67.05 v86.45,67.05 85.15,67.05 84.29,66.19 84.29,54.28 85.98,52.59 96.58,52.59 97.89,51.28 97.89,10.22 96.78,9.11 95.08,9.11 93.1,7.13 93.1,7.12 91.35,5.37 91.35,3.98 90.98,3.62 73.13,3.62 72.85,3.9 v72.85,4.65
VC_SPI_CLK
  Top 0.127: U1.25_2 73.1,33.3 73.81,34.01 88.01,34.01 90.97,31.05 97.16,31.05 98.51,29.71 98.51,21.41 97.56,20.46 JP5.2
VC_SPI_CS0
  Top 0.127: U1.28_2 71.83,33.43 72.66,34.26 88.12,34.26 91.07,31.31 97.27,31.31 98.76,29.82 98.76,19.1 97.58,17.92 JP5.1
VC_SPI_MISO
  Top 0.127: JP5.3 97.5,23 98.25,23.75 98.25,29.61 97.06,30.8 90.86,30.8 87.91,33.75 74.95,33.75 74.37,33.17 U1.26_2 74.37,31.8
VC_SPI_MOSI
  Top 0.127: U1.27_2 75.64,33.04 76.1,33.5 87.8,33.5 90.77,30.53 96.97,30.53 98,29.5 98,26 97.54,25.54 JP5.4
VIN
  pour Top (no thermals): 9.4,11.6 16.5,11.6 16.5,21.1 13.8,21.1 13.8,16.9 9.4,16.9
VOCORE_RXD2  (via drill 0.31)
  Top 0.127: U1.44_2 63.46,16.72 JP4.3 | IC8.1 54.15,19.24 v54.15,18.2
  Bottom 0.127: JP4.3 62.96,14.76 63.3,15.1 63.3,18.01 62.61,18.7 54.36,18.7 54.15,18.5 v54.15,18.2
VOCORE_TXD2  (via drill 0.31)
  Top 0.127: U1.43_2 63.35,17.99 JP4.1 | IC8.4 52.2,19.25 v52.2,18.2
  Bottom 0.127: JP4.1 61.5,19.2 61.26,18.96 52.46,18.96 52.2,18.7 v52.2,18.2
X1_3V3  (via drill 0.31, 0.35)
  Top 0.25: X1.41 90.9,42.5 91.2,42.2 93.8,42.2 v94.3,41.7
  Top 0.4: C33.1 72.17,59.5 IC4.4
  Top 0.5: X1.39 X1.41 90.9,47.9 91,48 | X1.52 95.3,49.4 93.9,48 91,48 | X1.24 84.1,48 | 84.1,48 91,48 | 84.1,48 73.3,48 v73.05,48.25 72.1,49.2 X1.2 72.1,56.4 L10.2 72.53,56.84 IC4.4
  Top 0.6: D7.4 X1.52
  Bottom 0.25: v94.3,41.7 R2.2
  Bottom 0.4: JP10.1 72.4,43.6 71.3,44.7 71.3,46.1 73.05,47.85 v73.05,48.25
X1_P3  (via drill 0.35)
  Top 0.4: X1.3 v72.5,45.3
  Bottom 0.4: v72.5,45.3 74.7,43.1 74.7,38.8 75.17,38.33 JP3.1
X1_P5  (via drill 0.35)
  Top 0.4: X1.5 v73.3,45.5
  Bottom 0.4: v73.3,45.5 75.88,42.92 JP3.2
X1_P8  (via drill 0.31)
  Top 0.4: X1.8 v74.5,50.7
  Bottom 0.4: v74.5,50.7 74.5,46.5 77,44 77,38.8 77.47,38.33 JP3.3
X1_P10  (via drill 0.31)
  Top 0.4: X1.10 v75.3,50.7
  Bottom 0.4: v75.3,50.7 75.3,46.49 78.39,43.4 78.39,40.9 JP3.4
X1_P12  (via drill 0.31)
  Top 0.4: X1.12 v76.1,50.7
  Bottom 0.4: v76.1,50.7 76.1,46.48 79.6,42.98 79.6,39 80.27,38.33 JP3.5
X1_P14  (via drill 0.31)
  Top 0.4: X1.14 v76.9,50.7
  Bottom 0.4: JP3.6 80.96,42.38 76.9,46.44 v76.9,50.7
X1_P16  (via drill 0.31)
  Top 0.4: X1.16 v77.7,50.7
  Bottom 0.4: v77.7,50.7 77.7,46.4 82.2,41.9 82.2,39 82.87,38.33 JP3.7
X1_P20  (via drill 0.31)
  Top 0.4: X1.20 v82.5,50.7
  Bottom 0.4: v82.5,50.7 82.5,46.45 83.5,45.45 JP3.8
X1_P22  (via drill 0.31)
  Top 0.4: X1.22 v83.3,50.7
  Bottom 0.4: JP3.9 85.27,38.33 84.7,38.9 84.7,45 83.3,46.4 v83.3,50.7
X1_P42  (via drill 0.31)
  Top 0.4: X1.42 v91.3,50.7
  Bottom 0.4: v91.3,50.7 91.3,49.69 86.76,45.15 86.76,41.59 JP3.10
X1_P44  (via drill 0.31)
  Top 0.4: X1.44 v92.1,50.7
  Bottom 0.4: v92.1,50.7 92.1,49.7 87.3,44.9 87.3,38.9 87.87,38.33 JP3.11
X1_P46  (via drill 0.31)
  Top 0.4: X1.46 v92.9,50.7
  Bottom 0.4: v92.9,50.7 92.73,50.53 92.73,49.54 87.84,44.65 87.84,41.61 JP3.12
X1_P49  (via drill 0.31)
  Top 0.4: X1.49 v94.1,45.3
  Bottom 0.4: JP3.14 91.12,44.22 92.2,45.3 v94.1,45.3
X1_P51  (via drill 0.31)
  Top 0.4: X1.51 v94.9,45.3
  Bottom 0.4: v94.9,45.3 94.73,45.13 94.73,44.94 94.36,44.57 93.84,44.57 93.7,44.71 92.4,44.71 91.66,43.97 91.66,41.87 92.21,41.32 92.21,38.71 91.83,38.33 JP3.13
X1_USB_D+
  Top 0.15: IC2.5 52.7,35.3 53.8,36.4 94.8,36.4 95.6,37.2 95.6,45.74 97.36,47.5 97.36,54.95 96.81,55.5 93.4,55.5 | X1.38 89.7,55 90.2,55.5 93.4,55.5 | D7.3 93.4,55.5
X1_USB_D-
  Top 0.15: IC2.4 53.34,35.54 53.92,36.12 94.95,36.12 95.89,37.05 95.89,45.54 97.65,47.3 97.65,55.1 96.96,55.79 93.4,55.79 | 93.4,55.79 90.1,55.79 89.42,55.12 89.42,53.8 88.9,53.28 X1.36 | D7.2 93.4,55.79
X2_3V3  (via drill 0.31, 0.35)
  Top 0.25: X2.41 57.4,42.7 57.8,42.3 60.2,42.3 v60.8,41.7
  Top 0.4: C12.1 38.62,59.5 IC3.4
  Top 0.5: X2.39 X2.41 57.4,48 | X2.52 61.8,49.5 60.3,48 57.4,48 | 57.4,48 50.5,48 | 50.5,48 40,48 v39.7,48.3 38.6,49.4 X2.2 38.6,56.62 38.98,57 | X2.24 50.6,48.1 50.5,48 | IC3.4 38.98,57 | 38.98,57 38.98,56.84 L2.2
  Top 0.6: D6.4 X2.52
  Bottom 0.25: v60.8,41.7 R4.2
  Bottom 0.4: JP9.1 38.9,43.9 37.8,45 37.8,46.2 39.7,48.1 v39.7,48.3
X2_P3  (via drill 0.31)
  Top 0.3: X2.3 v39,45.3
  Bottom 0.3: v39,45.3 39.22,45.08 39.22,45.06 41.02,43.25 41.02,38.88 41.58,38.33 JP1.1
X2_P5  (via drill 0.31)
  Top 0.3: X2.5 v39.8,45.3
  Bottom 0.3: v39.8,45.3 39.8,45.1 42.38,42.52 JP1.2
X2_P8  (via drill 0.31)
  Top 0.3: X2.8 v41,50.7
  Bottom 0.3: v41,50.7 41,46.6 43.6,44 43.6,38.9 44.17,38.33 JP1.3
X2_P10  (via drill 0.31)
  Top 0.3: X2.10 v41.8,50.7
  Bottom 0.3: v41.8,50.7 41.8,46.45 44.9,43.35 44.9,40.87 JP1.4
X2_P12  (via drill 0.31)
  Top 0.3: X2.12 v42.6,50.7
  Bottom 0.3: v42.6,50.7 42.6,46.3 46.2,42.7 46.2,39.1 46.97,38.33 JP1.5
X2_P14  (via drill 0.31)
  Top 0.3: X2.14 v43.4,50.7
  Bottom 0.3: v43.4,50.7 43.4,46.15 47.46,42.09 JP1.6
X2_P16  (via drill 0.31)
  Top 0.3: X2.16 v44.2,50.7
  Bottom 0.3: v44.2,50.7 44.25,50.65 44.25,45.95 48.7,41.5 48.7,38.8 49.2,38.3 49.23,38.33 JP1.7
X2_P20  (via drill 0.31)
  Top 0.3: X2.20 v49,50.7
  Bottom 0.3: v49,50.7 49,45.8 50,44.8 JP1.8
X2_P22  (via drill 0.31)
  Top 0.3: X2.22 v49.8,50.7
  Bottom 0.3: v49.8,50.7 49.8,45.65 51.24,44.21 51.24,38.66 51.6,38.3 51.63,38.33 JP1.9
X2_P42  (via drill 0.31)
  Top 0.3: X2.42 v57.8,50.7
  Bottom 0.3: v57.8,50.7 57.8,49.2 53.36,44.76 53.36,41.69 JP1.10
X2_P44  (via drill 0.31)
  Top 0.3: X2.44 v58.6,50.7
  Bottom 0.3: v58.6,50.7 58.6,49.35 53.8,44.55 53.8,39 54.5,38.3 54.53,38.33 JP1.11
X2_P46  (via drill 0.31)
  Top 0.3: X2.46 v59.4,50.7
  Bottom 0.3: v59.4,50.7 59.4,49.5 54.24,44.34 54.24,41.71 JP1.12
X2_P49  (via drill 0.31)
  Top 0.4: X2.49 v60.6,45.3
  Bottom 0.4: v60.6,45.3 60.55,45.35 58.65,45.35 57.57,44.27 57.57,40.92 JP1.14
X2_P51  (via drill 0.31)
  Top 0.4: X2.51 v61.4,45.3
  Bottom 0.4: v61.4,45.3 61.23,45.13 61.23,45.04 60.86,44.67 60.34,44.67 60.2,44.81 58.9,44.81 58.11,44.02 58.11,41.92 58.71,41.32 58.71,38.61 58.4,38.3 58.37,38.33 JP1.13
X2_USB_D+
  Top 0.15: X2.38 56.2,55.05 56.65,55.5 59.9,55.5 | IC2.7 51.42,34.82 53.6,37 61.46,37 62.06,37.6 62.06,46.16 63.7,47.8 63.7,54.9 63.1,55.5 59.9,55.5 | D6.3 59.9,55.5
X2_USB_D-
  Top 0.15: IC2.6 52.06,35.06 53.71,36.71 61.61,36.71 62.35,37.45 62.35,45.96 63.99,47.6 63.99,55.05 63.25,55.79 59.9,55.79 | 59.9,55.79 56.55,55.79 55.92,55.16 55.92,53.9 55.4,53.38 X2.36 | D6.2 59.9,55.79
X3_3V3  (via drill 0.31, 0.35)
  Top 0.25: X3.41 23.9,42.7 24.4,42.2 26.8,42.2 v27.3,41.7
  Top 0.5: X3.39 X3.41 23.9,48 | X3.52 28.3,51.6 28.3,49.5 26.8,48 23.9,48 | 23.9,48 17.1,48 | 17.1,48 6.8,48 v6.55,48.25 5.1,49.7 X3.2 L3.2 5.48,56.84 5.48,59 | X3.24 17.1,48 | IC5.4 5.48,59 | C14.1 4.98,59.5 5.48,59
  Top 0.6: D5.4 28.3,51.6
  Bottom 0.25: v27.3,41.7 R5.2
  Bottom 0.4: JP8.1 5.4,43.3 4.4,44.3 4.4,46.1 v6.55,48.25
X3_P3  (via drill 0.35)
  Top 0.4: X3.3 v5.5,45.3
  Bottom 0.4: JP2.1 7.7,39.51 7.7,43.1 v5.5,45.3
X3_P5  (via drill 0.35)
  Top 0.4: X3.5 v6.3,45.5
  Bottom 0.4: v6.3,45.5 8.88,42.92 JP2.2
X3_P8  (via drill 0.31)
  Top 0.4: X3.8 v7.5,50.7
  Bottom 0.4: v7.5,50.7 7.5,46.2 10.1,43.6 10.1,39.1 10.87,38.33 JP2.3
X3_P10  (via drill 0.31)
  Top 0.4: X3.10 v8.3,50.7
  Bottom 0.4: v8.3,50.7 8.3,50.5 8.29,50.49 8.29,46.2 11.42,43.07 JP2.4
X3_P12  (via drill 0.31)
  Top 0.4: X3.12 v9.1,50.7
  Bottom 0.4: v9.1,50.7 9.1,46.18 12.6,42.68 12.6,38.9 13.2,38.3 13.23,38.33 JP2.5
X3_P14  (via drill 0.31)
  Top 0.4: X3.14 v9.9,50.7
  Bottom 0.4: v9.9,50.7 9.9,46.17 13.96,42.11 JP2.6
X3_P16  (via drill 0.31)
  Top 0.4: X3.16 v10.7,50.7
  Bottom 0.4: v10.7,50.7 10.7,46.17 15.2,41.67 15.2,38.8 15.67,38.33 JP2.7
X3_P20  (via drill 0.31)
  Top 0.4: X3.20 v15.5,50.7
  Bottom 0.4: v15.5,50.7 15.5,45.9 16.5,44.9 JP2.8
X3_P22  (via drill 0.31)
  Top 0.4: X3.22 v16.3,50.7
  Bottom 0.4: v16.3,50.7 16.3,45.99 17.69,44.6 17.69,38.81 18.17,38.33 JP2.9
X3_P42  (via drill 0.31)
  Top 0.4: X3.42 v24.3,50.7
  Bottom 0.4: v24.3,50.7 24.3,49.6 19.66,44.96 19.66,41.49 JP2.10
X3_P44  (via drill 0.31)
  Top 0.4: X3.44 v25.1,50.7
  Bottom 0.4: v25.1,50.7 25.1,49.61 20.2,44.71 20.2,38.9 20.8,38.3 20.83,38.33 JP2.11
X3_P46  (via drill 0.31)
  Top 0.4: X3.46 v25.9,50.7
  Bottom 0.4: v25.9,50.7 25.73,50.53 25.73,49.45 20.75,44.47 20.75,41.7 JP2.12
X3_P49  (via drill 0.31)
  Top 0.3: X3.49 v27.1,45.35
  Bottom 0.3: v27.1,45.35 24.85,45.35 24.07,44.57 24.07,40.92 JP2.14
X3_P51  (via drill 0.31)
  Top 0.3: X3.51 v27.9,45.3
  Bottom 0.3: v27.9,45.3 27.68,45.08 27.68,45.06 27.34,44.72 26.86,44.72 26.67,44.91 25.06,44.91 24.52,44.38 24.52,41.93 25.16,41.3 25.16,38.76 24.73,38.33 JP2.13
X3_USB_D+
  Top 0.15: X3.38 22.7,54.95 23.3,55.55 26.4,55.55 | IC2.9 50.14,35.46 49.5,36.1 33.5,36.1 32.4,37.2 32.4,54.75 31.6,55.55 26.4,55.55 | D5.3 26.4,55.55
X3_USB_D-
  Top 0.15: IC2.8 50.8,33.12 50.8,33.9 50.43,34.27 50.43,35.61 49.65,36.39 33.65,36.39 32.69,37.35 32.69,54.9 31.75,55.84 26.4,55.84 | 26.4,55.84 23.2,55.84 22.42,55.06 22.42,53.9 21.9,53.38 X3.36 | D5.2 26.4,55.84

## Text on the board
tNames: GND | MOSI | MISO | TXD | CLK | !CS | +5V | !RESET | VUSB
bNames: PE | GND | 24V